# EAGLE design Reaccion-vReg (EAGLE 7.4.0)
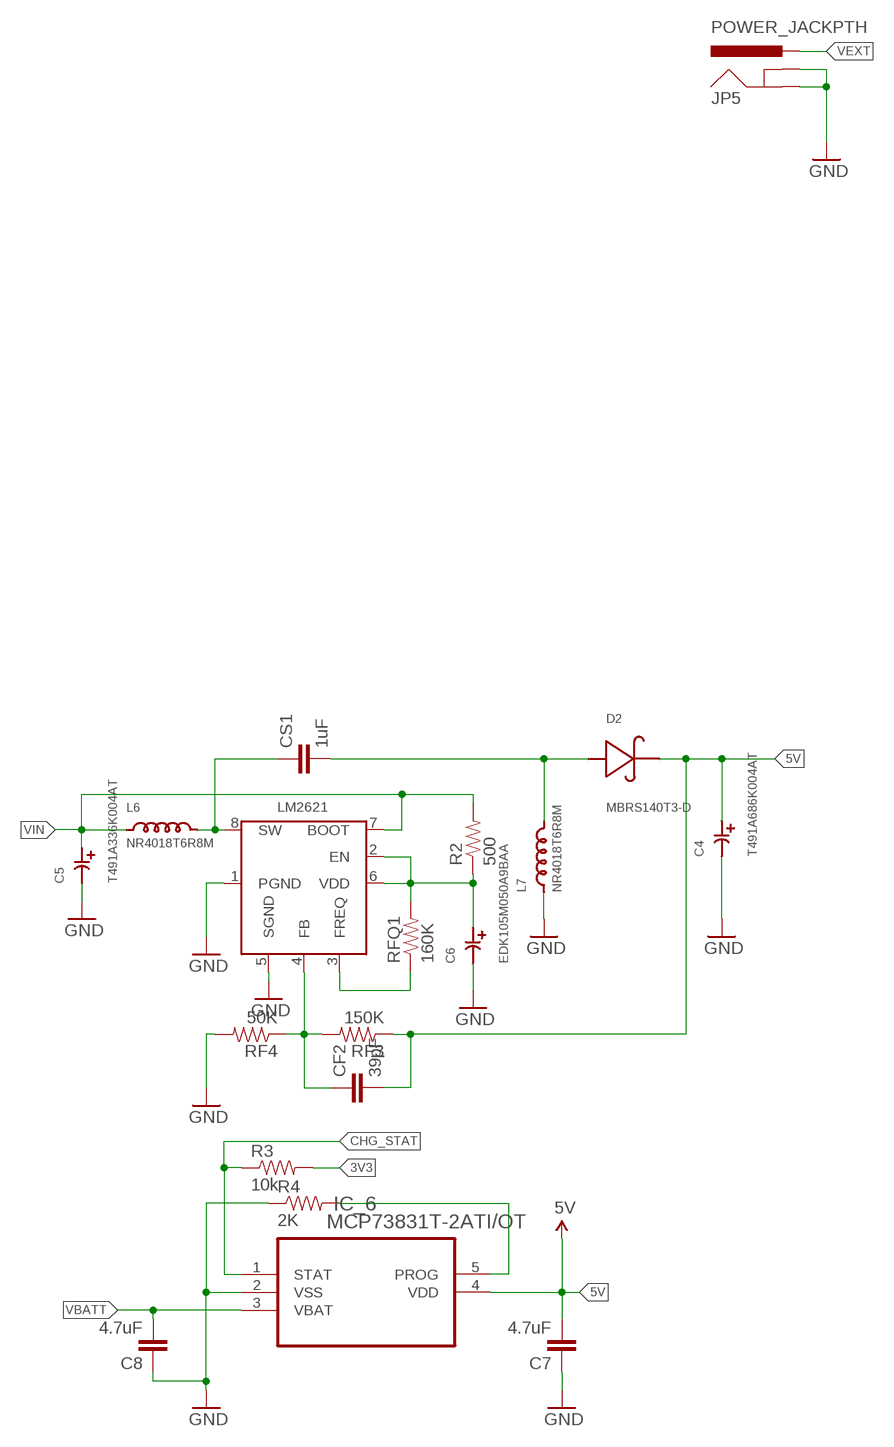
[diagram p0: schematic, sheet 1]

## Parts
C4  T491A686K004AT  [3216-18]
C5  T491A336K004AT  [3216-18]
C6  EDK105M050A9BAA  [EDK105M050A9BAA]
C7  4.7uF  CAP0805  [0805]
C8  4.7uF  CAP0805  [0805]
CF2  39pF  CAP0805  [0805]
CS1  1uF  CAP0805  [0805]
D2  MBRS140T3-D  [MBRS140T3G]
IC_4  LM2621  [R-PDSO-G8]
IC_6  MCP73831T-2ATI/OT  [SOT95P300X145-5N]
JP5  POWER_JACKPTH  [POWER_JACK_PTH]
L6  NR4018T6R8M  [NR4018/NRS4018]
L7  NR4018T6R8M  [NR4018/NRS4018]
R2  500  RESISTOR0805-RES  [0805]
R3  10k  RESISTOR0805-RES  [0805]
R4  2K  RESISTOR0805-RES  [0805]
RF3  150K  RESISTOR0805-RES  [0805]
RF4  50K  RESISTOR0805-RES  [0805]
RFQ1  160K  RESISTOR0805-RES  [0805]

## Nets
3V3: R3.2
5V: C4.1 C7.2 CF2.2 D2.2 IC_6.4(VDD) RF3.1
CHG_STAT: IC_6.1(STAT) R3.1
GND: C4.2 C5.2 C6.P$2 C7.1 C8.1 IC_4.1(PGND) IC_4.5(SGND) IC_6.2(VSS) JP5.GND JP5.GNDBREAK L7.P$1 R4.1 RF4.2
N$2: CS1.1 IC_4.8(SW) L6.P$2
N$6: C6.P$1 IC_4.2(EN) IC_4.6(VDD) R2.1 RFQ1.2
N$8: IC_4.3(FREQ) RFQ1.1
N$9: CF2.1 IC_4.4(FB) RF3.2 RF4.1
N$10: CS1.2 D2.1 L7.P$2
N$11: IC_6.5(PROG) R4.2
VBATT: C8.2 IC_6.3(VBAT)
VEXT: JP5.PWR
VIN: C5.1 IC_4.7(BOOT) L6.P$1 R2.2

## Library data of the parts
C4 = custom_componentsv0.9:T491A686K004AT
C5 = custom_componentsv0.9:T491A336K004AT
C6 = custom_componentsv0.9:EDK105M050A9BAA
C7 C8 CF2 CS1 = SparkFun-Capacitors:CAP: Capacitor Standard 0603 ceramic capacitor, and 0.1" leaded capacitor.
D2 = custom_componentsv0.9:MBRS140T3-D
IC_4 = custom_componentsv0.9:LM2621
IC_6 = custom_components:MCP73831T-2ATI/OT: IC, BATT CHARGER, Li-Ion Li-Polymer, 500 mA; MPN: MCP73831T-2ATI/OT; OC_FARNELL: 1834890; OC_NEWARK: 84R5196; PACKAGE: SOT23-5; SUPPLIER: Microchip
JP5 = SparkFun-Connectors:POWER_JACK: Power Jack This is the standard 5.5mm barrel jack for power. The PTH is the most common, proven, reliable, footprint. The Slot footprint only works if the mill layer is transmitted to the PCB fab house so be warned. Mating wall wart : TOL-00298 (and others); PROD_ID: CONN-08197
L6 L7 = custom_componentsv0.9:NR4018T6R8M
R2-R4 RF3 RF4 RFQ1 = SparkFun-Resistors:RESISTOR: Resistor Basic schematic elements and footprints for 0603, 1206, and PTH resistors.

## Net classes
0 default: clearance 0.205 mm

## Board
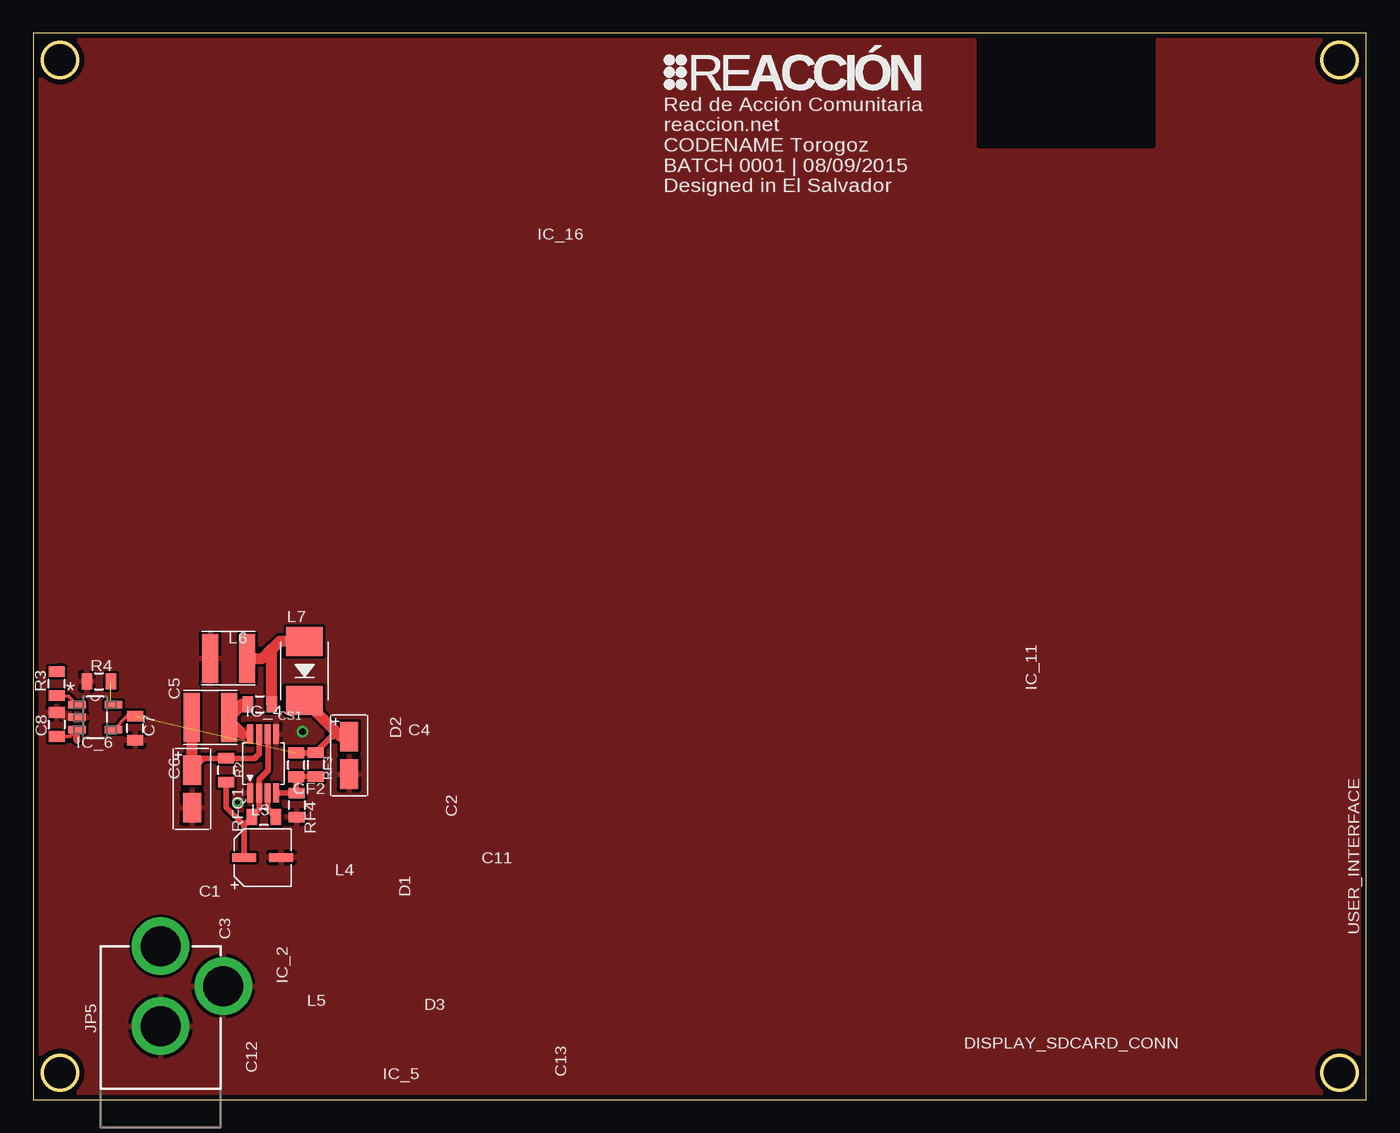
[diagram p1: board, top side]
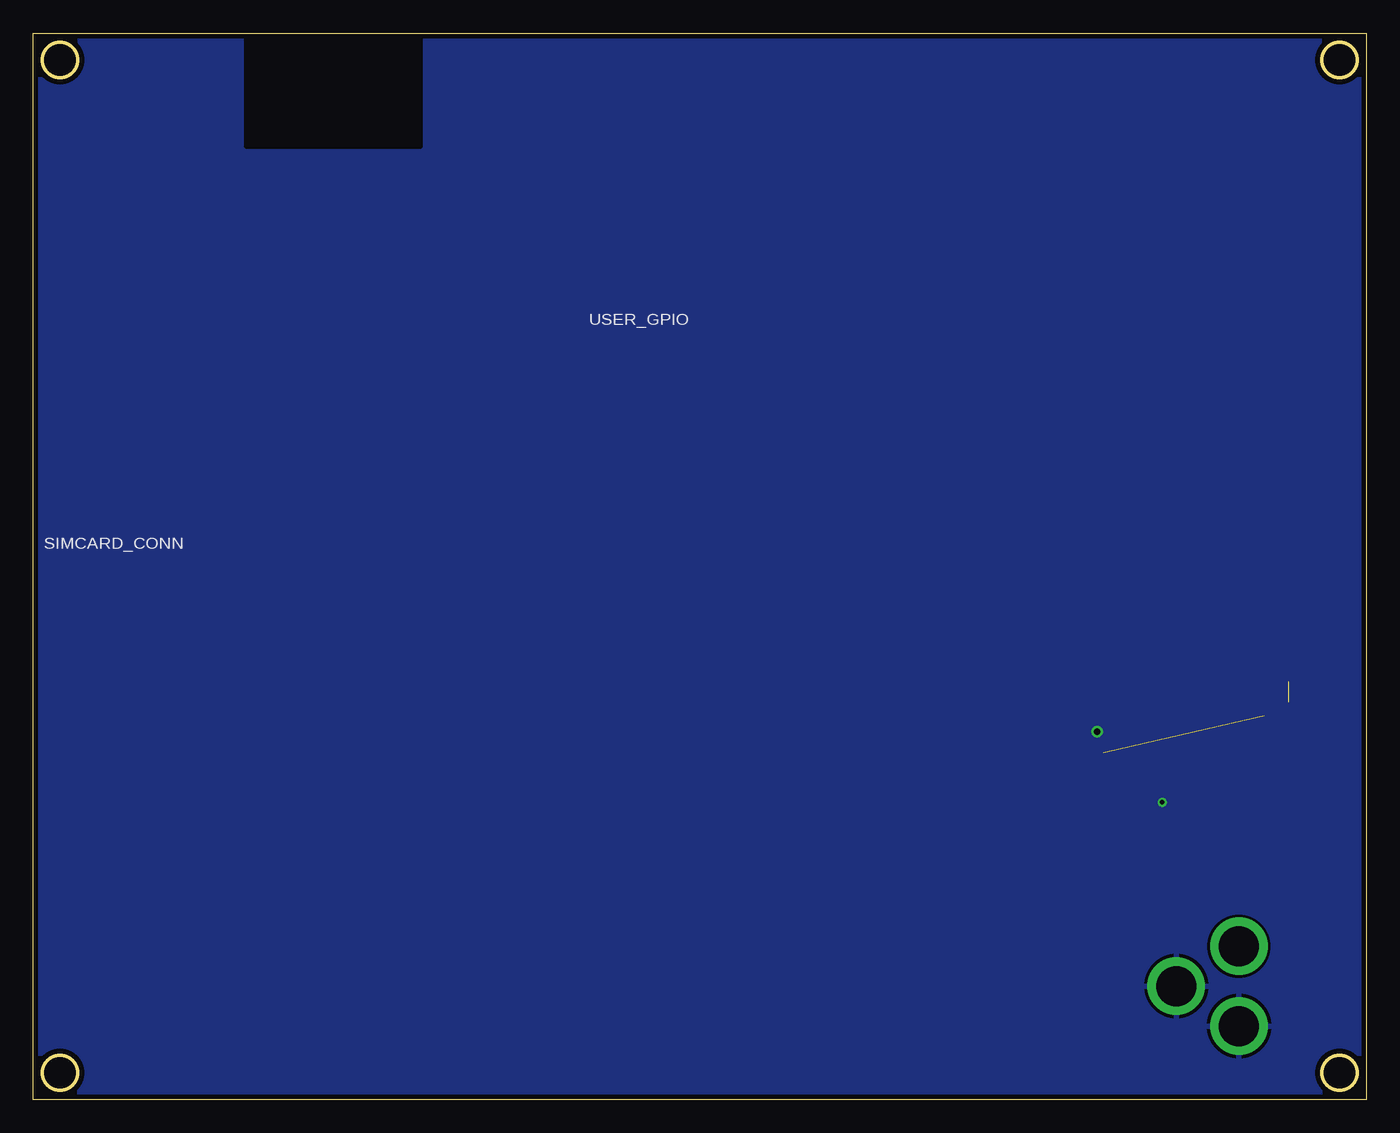
[diagram p2: board, bottom side, seen from below]

Size 100 x 80 mm. Coordinates in mm from the lower left corner, seen from the top.
Outline: 0,0 100,0 100,80 0,80 0,0
Outline: circle at 2,78 radius 1.3
Outline: circle at 98,78 radius 1.3
Outline: circle at 98,2 radius 1.3
Outline: circle at 2,2 radius 1.3
Copper layers (1*16): Top 0.0356mm / dielectric 1.5011mm / Bottom 0.0356mm
Design rules "LaenPCBOrder": minimum track width 6mil, minimum drill 13mil, track to track 6mil, track to pad 6mil, pad to pad 6mil, via to via 6mil, smd to smd 6mil, copper to edge 15mil, drill to drill 6mil, minimum pad ring 7mil, minimum via ring 7mil, stop-mask expansion 3mil, vias tented up to drill 0mil, thermal gap 10mil
tRestrict: area 71,71.6 to 84,80
bRestrict: area 71,71.5 to 84,80

### Footprints (pad centres in the part's own frame; a part is rotated, then mirrored left to right if it is on the bottom)
3216-18 = smd 2.2 x 1.35: 1 1.41,0; 2 -1.41,0
EDK105M050A9BAA = smd 1.8 x 0.65: P$1 1.4,0; P$2 -1.4,0
0805 = smd 0.8 x 1.2: 1 -0.9,0; 2 0.9,0
MBRS140T3G = smd 2.159 x 2.743: 1 2.21,0; 2 -2.21,0
R-PDSO-G8 = smd 0.45 x 1.45: 1 -0.975,-2.2; 2 -0.325,-2.2; 3 0.325,-2.2; 4 0.975,-2.2; 5 0.975,2.2; 6 0.325,2.2; 7 -0.325,2.2; 8 -0.975,2.2
SOT95P300X145-5N = smd 1.321 x 0.559: 1 -1.372,0.94; 2 -1.372,0; 3 -1.372,-0.94; 4 1.372,-0.94; 5 1.372,0.94
POWER_JACK_PTH = drill 2.997 pad 4.318: GND 0,7.7; GNDBREAK 4.7,10.7; PWR 0,13.7
NR4018/NRS4018 = smd 1.2 x 3.7: P$1 -1.4,0; P$2 1.4,0

### Placement (x,y rotation side)
C4  23.69,25.82 90 top
C5  11.9,23.3 90 top
C6  17.21,18.16 180 top
C7  7.63,27.87 90 top
C8  1.75,28.14 270 top
CF2  19.72,25.1 90 top
CS1  16.99,29.65 0 top
D2  20.35,32.16 90 top
IC_4  17.26,25.21 0 top
IC_6  4.64,28.68 0 top
JP5  9.55,-2.19 0 top
L6  13.28,28.67 0 top
L7  14.65,33.1 0 top
R2  14.49,24.7 90 top
R3  1.75,31.2 90 top
R4  4.92,31.37 0 top
RF3  21.19,25.13 270 top
RF4  19.76,22.09 270 top
RFQ1  17.29,21.19 180 top

### Tracks (layer width: path | path; a pad name or v marks a point on that pad's centre or on a via)
3V3
  Top 0.61: 2,32.27 R3.2
5V  (1 unrouted)
  Top 0.254: 6.06,27.79 IC_6.4 7.04,28.77 C7.2
  Top 0.406: 23.07,27.23 22.38,27.23 RF3.1 21.16,26 CF2.2
  Top 0.813: D2.2 23.07,27.23 C4.1
CHG_STAT
  Top 0.254: IC_6.1 2.65,30.24 R3.1
GND  (via drill 0.33, 0.5)
  other vias: 20.2,27.6 15.3,22.3
  pour Top: 0,0 99.95,0 99.95,79.94 0,79.94
  pour Bottom: 0,0 100.19,0 100.19,80.03 0.13,80.03
N$2
  Top 0.254: 15.7,27.4 IC_4.8
  Top 0.813: CS1.1 15.66,29.65 L6.P$2 14.68,28.42 15.7,27.4
  pour Top (no thermals): 15.7,27.1 16.1,26.8 16.4,26.8 16.4,28 16.1,28 15.7,27.7
N$6
  Top 0.406: C6.P$1 15.81,20.61 | 15.81,20.61 RFQ1.2 16.93,21.73 IC_4.2 16.93,24.03 17.6,24.7 17.6,27.39 IC_4.6 | R2.1 14.49,21.93 15.81,20.61
N$8
  Top 0.406: IC_4.3 17.58,21.8 RFQ1.1
N$9
  Top 0.406: IC_4.4 19.74,23.01 RF4.1 19.72,23.03 CF2.1 19.75,24.23 RF3.2
N$10
  Top 0.813: CS1.2 17.89,33.79 | 17.89,33.79 18.05,33.95 18.5,34.4 20.32,34.4 D2.1 | L7.P$2 17.2,33.1 17.89,33.79
N$11  (1 unrouted)
  Top 0.254: IC_6.5 5.82,29.82
VBATT
  Top 0.254: C8.2 2.77,27.24 IC_6.3
  Top 0.508: 3.27,26.97 IC_6.3
VIN
  Top 0.406: IC_4.7 16.93,25.93 16.6,25.6 R2.2 12.79,25.6 C5.1
  Top 0.813: C5.1 11.9,28.65 L6.P$1

### Text on the board
tNames: Red de Acción Comunitaria / reaccion.net / CODENAME Torogoz / BATCH 0001 | 08/09/2015 / Designed in El Salvador | IC_16 | L7 | L6 | IC_11 | C5 | IC_4 | D2 | C4 | C6 | L3 | C2 | C11 | L4 | C1 | D1 | C3 | USER_INTERFACE | IC_2 | L5 | D3 | DISPLAY_SDCARD_CONN | C12 | IC_5 | C13
bNames: USER_GPIO | SIMCARD_CONN